# EAGLE design Steuerung (EAGLE 7.1.0)
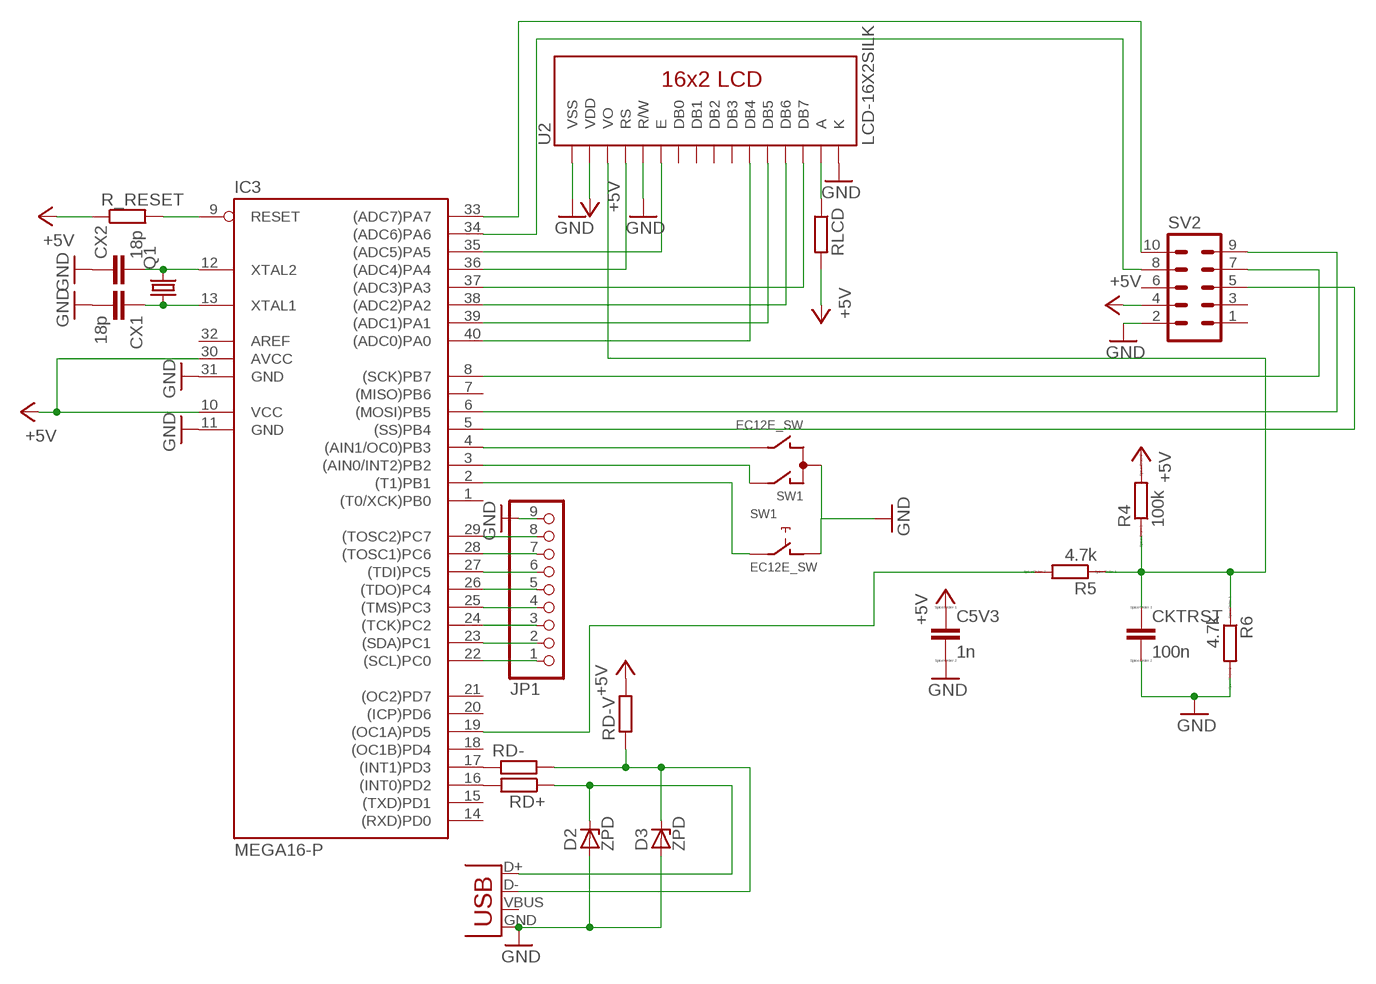
[diagram p0: schematic, sheet 1]

## Parts
C5V3  1n  C-EUC1206K  [C1206K]
CKTRST  100n  C-EUC1206K  [C1206K]
CX1  18p  C2,5-3  [C2.5-3]
CX2  18p  C2,5-3  [C2.5-3]
D2  ZPD  [DO35Z10]
D3  ZPD  [DO35Z10]
IC3  MEGA16-P  [DIL40]
JP1  PINHD-1X9  [1X09]
JP2  USBPTH-VERTICAL  [USB-B-PTH-VERTICAL]
Q1  CRYSTALHC18U-V  [HC18U-V]
R4  100k  R-EU_R1206W  [R1206W]
R5  4.7k  R-EU_R1206W  [R1206W]
R6  4.7k  R-EU_R1206W  [R1206W]
R_RESET  R-EU_R1206W  [R1206W]
RD+  R-EU_0309/12  [0309/12]
RD-  R-EU_0309/12  [0309/12]
RD-V  R-EU_0309/12  [0309/12]
RLCD  R-EU_0309/12  [0309/12]
SV2  ML10  [ML10]
SW1  EC12E_SW  [ALPS_EC12E_SW]
U2  LCD-16X2SILK  [LCD-16X2]

## Nets
+5V: C5V3.1 IC3.10(VCC) IC3.30(AVCC) R4.2 R_RESET.1 RD-V.2 RLCD.2 SV2.4 U2.2(VDD)
GND: C5V3.2 CKTRST.2 CX1.2 CX2.1 D2.A D3.A IC3.11(GND) IC3.31(GND) JP1.9 JP2.GND R6.2 SV2.2 SW1.C SW1.D U2.1(VSS) U2.5(R/W) U2.16(K)
KONTRAST: CKTRST.1 R4.1 R5.1 R6.1 U2.3(VO)
N$1: IC3.34((ADC6)PA6) SV2.8
N$2: IC3.4((AIN1/OC0)PB3) SW1.B
N$3: IC3.3((AIN0/INT2)PB2) SW1.A
N$4: IC3.2((T1)PB1) SW1.E
N$5: IC3.9(RESET) R_RESET.2
N$9: IC3.37((ADC3)PA3) U2.14(DB7)
N$10: IC3.36((ADC4)PA4) U2.4(RS)
N$11: IC3.35((ADC5)PA5) U2.6(E)
N$12: IC3.38((ADC2)PA2) U2.13(DB6)
N$13: IC3.39((ADC1)PA1) U2.12(DB5)
N$14: IC3.40((ADC0)PA0) U2.11(DB4)
N$15: RLCD.1 U2.15(A)
N$17: IC3.33((ADC7)PA7) SV2.10
N$18: IC3.5((SS)PB4) SV2.5
N$19: IC3.8((SCK)PB7) SV2.7
N$20: IC3.6((MOSI)PB5) SV2.9
N$21: IC3.29((TOSC2)PC7) JP1.8
N$22: IC3.28((TOSC1)PC6) JP1.7
N$23: IC3.27((TDI)PC5) JP1.6
N$24: IC3.26((TDO)PC4) JP1.5
N$25: IC3.25((TMS)PC3) JP1.4
N$26: IC3.24((TCK)PC2) JP1.3
N$27: IC3.23((SDA)PC1) JP1.2
N$28: IC3.22((SCL)PC0) JP1.1
N$29: CX1.1 IC3.13(XTAL1) Q1.1
N$30: CX2.2 IC3.12(XTAL2) Q1.2
N$31: IC3.16((INT0)PD2) RD+.2
N$32: IC3.17((INT1)PD3) RD-.1
N$33: D2.C JP2.D+ RD+.1
N$34: D3.C JP2.D- RD-.2 RD-V.1
PWM: IC3.19((OC1A)PD5) R5.2
Unconnected: IC3.1((T0/XCK)PB0) IC3.7((MISO)PB6) IC3.14((RXD)PD0) IC3.15((TXD)PD1) IC3.18((OC1B)PD4) IC3.20((ICP)PD6) IC3.21((OC2)PD7) IC3.32(AREF) JP2.VBUS SV2.1 SV2.3 SV2.6 SW1.GND1(G) SW1.GND2(G) U2.7(DB0) U2.8(DB1) U2.9(DB2) U2.10(DB3)

## Library data of the parts
C5V3 CKTRST = resistor:C-EU: CAPACITOR, European symbol; OC_FARNELL: unknown; SPICEPREFIX: C
CX1 CX2 = capacitor-wima:C: CAPACITOR naming: grid - package width; OC_FARNELL: unknown
D2 D3 = diode:ZPD: Z DIODE 500 mW; OC_FARNELL: unknown
IC3 = atmel:MEGA16-P: MICROCONTROLLER 16 Kbytes FLASH 1 kbytes SRAM 512 bytes EEPROM USART 8-channel 10 bit ADC Source: avr.lbr; MF: ATMEL; MPN: ATMEGA16-16PU; OC_FARNELL: 9171142; OC_NEWARK: 01M6885
JP1 = pinhead:PINHD-1X9: PIN HEADER; OC_FARNELL: unknown
JP2 = SparkFun-Connectors:USB: USB Connectors USB-B-PTH is fully proven SKU : PRT-00139/CONN-08278 USB-miniB is fully proven SKU : PRT-00587 USB-A-PCB is untested. USB-A-H is throughly reviewed, but untested. Spark Fun Electronics SKU : PRT-00437 USB-B-SMT is throughly reviewed, but untested. Needs silkscreen touching up. USB-A-S has not been used/tested USB-MB-H has not been used/tested USB-MICROB has been used. CONN-09505; OC_FARNELL: unknown
Q1 = crystal:CRYSTAL: CRYSTAL; OC_FARNELL: unknown; OC_NEWARK: unknown
R4-R6 = resistor:R-EU_: RESISTOR, European symbol; SPICEPREFIX: R
R_RESET RD+ RD- RD-V RLCD = rcl:R-EU_: RESISTOR, European symbol; OC_FARNELL: unknown
SV2 = con-harting-ml:ML10: HARTING; OC_FARNELL: unknown; OC_NEWARK: unknown
SW1 = switch-alps:EC12E_SW: ALPS rotary Encoder EC12E series with switch; MPN: EC12E2424407; OC_FARNELL: 1520813; OC_NEWARK: 74M1068
U2 = SparkFun-Displays:LCD-16X2: Standard text-only 16x2 parallel input LCD; OC_FARNELL: unknown

## Board
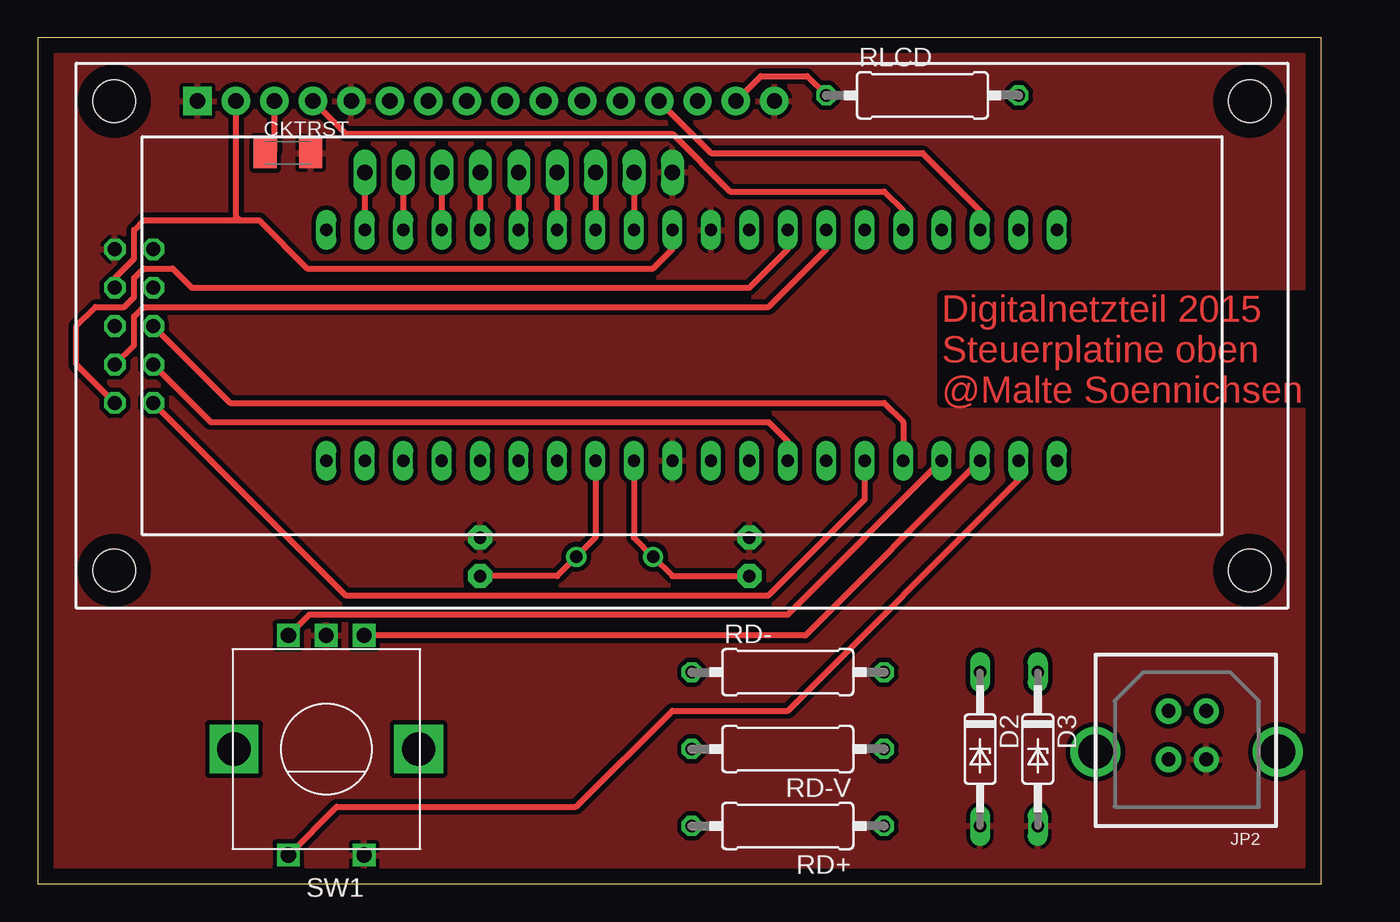
[diagram p1: board, top side]
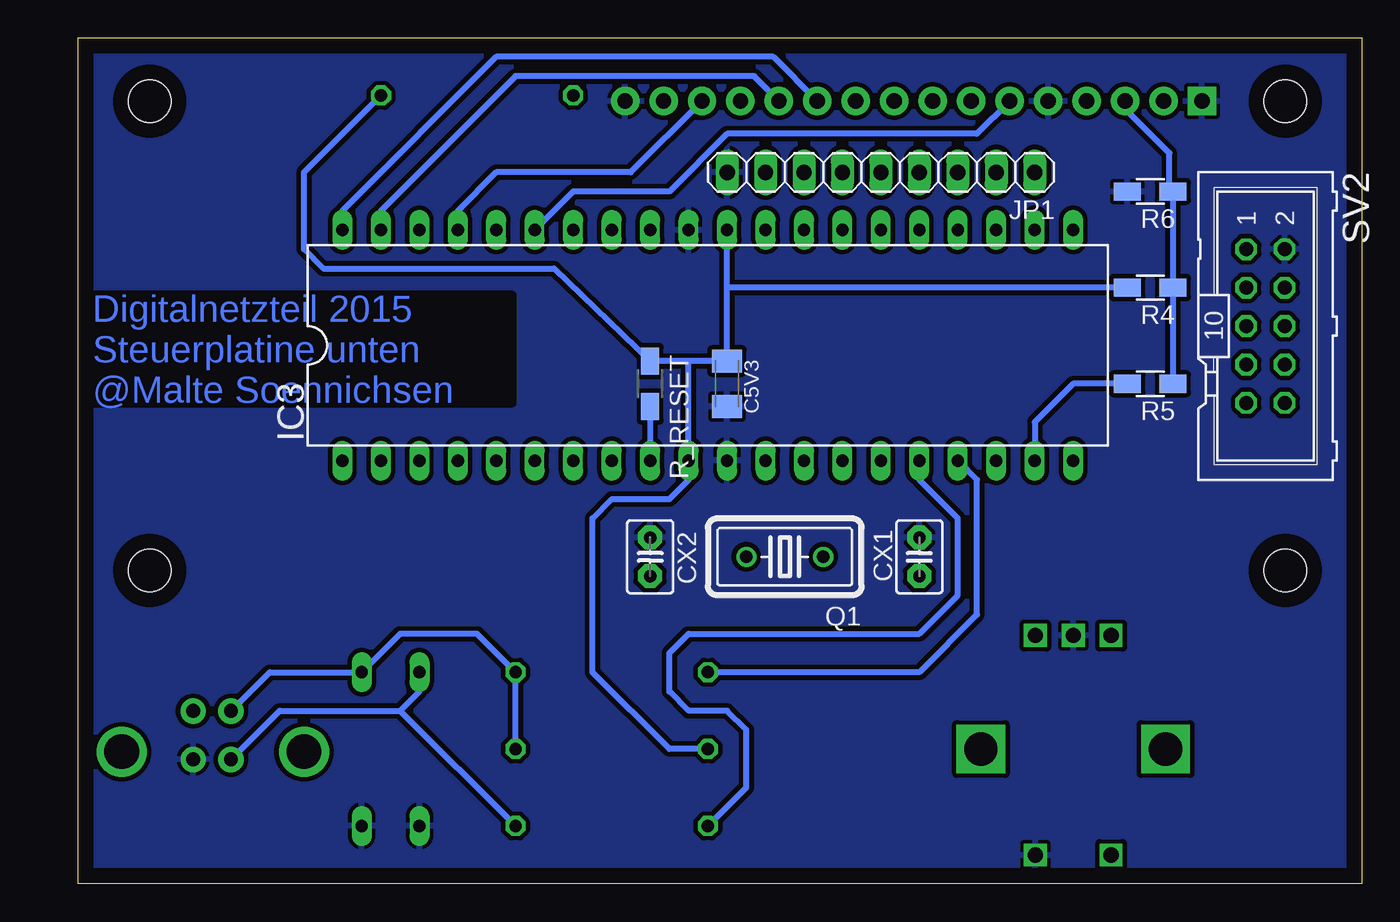
[diagram p2: board, bottom side, seen from below]

Size 84.76 x 55.87 mm. Coordinates in mm from the lower left corner, seen from the top.
Outline: 0,0 84.76,0 84.76,55.87 0,55.87 0,0
Copper layers (1*16): Top 0.035mm / dielectric 1.5mm / Bottom 0.035mm
Design rules "default": minimum track width 10mil, minimum drill 24mil, track to track 8mil, track to pad 8mil, pad to pad 8mil, via to via 8mil, smd to smd 8mil, copper to edge 40mil, drill to drill 8mil, minimum pad ring 10mil, minimum via ring 8mil, stop-mask expansion 4mil, vias tented up to drill 0mil, thermal gap 10mil

### Footprints (pad centres in the part's own frame; a part is rotated, then mirrored left to right if it is on the bottom)
C1206K = smd 1.5 x 2: 1 -1.5,0; 2 1.5,0
C2.5-3 = drill 0.813 pad 1.6 octagon: 1 -1.27,0; 2 1.27,0
DO35Z10 = drill 0.813 long: A 5.08,0; C -5.08,0
DIL40 = drill 0.813 long: 1 -24.13,-7.62; 2 -21.59,-7.62; 3 -19.05,-7.62; 4 -16.51,-7.62; 5 -13.97,-7.62; 6 -11.43,-7.62; 7 -8.89,-7.62; 8 -6.35,-7.62; 9 -3.81,-7.62; 10 -1.27,-7.62; 11 1.27,-7.62; 12 3.81,-7.62; 13 6.35,-7.62; 14 8.89,-7.62; 15 11.43,-7.62; 16 13.97,-7.62; 17 16.51,-7.62; 18 19.05,-7.62; 19 21.59,-7.62; 20 24.13,-7.62; 21 24.13,7.62; 22 21.59,7.62; 23 19.05,7.62; 24 16.51,7.62; 25 13.97,7.62; 26 11.43,7.62; 27 8.89,7.62; 28 6.35,7.62; 29 3.81,7.62; 30 1.27,7.62; 31 -1.27,7.62; 32 -3.81,7.62; 33 -6.35,7.62; 34 -8.89,7.62; 35 -11.43,7.62; 36 -13.97,7.62; 37 -16.51,7.62; 38 -19.05,7.62; 39 -21.59,7.62; 40 -24.13,7.62
1X09 = drill 1.016 long: 1 -10.16,0; 2 -7.62,0; 3 -5.08,0; 4 -2.54,0; 5 0,0; 6 2.54,0; 7 5.08,0; 8 7.62,0; 9 10.16,0
USB-B-PTH-VERTICAL = drill 0.914 pad 1.676: D+ 4.826,4.394; D- 4.826,7.595; GND 7.315,4.394; VBUS 7.315,7.595 | drill 2.286: P$1 0,4.902; P$2 12.04,4.902
HC18U-V = drill 0.813: 1 -2.54,0; 2 2.54,0
R1206W = smd 1.8 x 1.2: 1 -1.499,0; 2 1.499,0
0309/12 = drill 0.813 octagon: 1 -6.35,0; 2 6.35,0
ML10 = drill 0.914 octagon: 1 -5.08,-1.27; 2 -5.08,1.27; 3 -2.54,-1.27; 4 -2.54,1.27; 5 0,-1.27; 6 0,1.27; 7 2.54,-1.27; 8 2.54,1.27; 9 5.08,-1.27; 10 5.08,1.27
ALPS_EC12E_SW = drill 1 square: A -2.5,-7.5; B 2.5,-7.5; C 0,-7.5; D -2.5,7; E 2.5,7 | drill 2.2 square: GND1 -6.1,0; GND2 6.1,0
LCD-16X2 = drill 1.016 pad 1.88 square: 1 -32,15.5 | drill 1.016 pad 1.88: 2 -29.46,15.5; 3 -26.92,15.5; 4 -24.38,15.5; 5 -21.84,15.5; 6 -19.3,15.5; 7 -16.76,15.5; 8 -14.22,15.5; 9 -11.68,15.5; 10 -9.14,15.5; 11 -6.6,15.5; 12 -4.06,15.5; 13 -1.52,15.5; 14 1.02,15.5; 15 3.56,15.5; 16 6.1,15.5 | hole 2.8: -37.5,15.5; -37.5,-15.5; 37.5,15.5; 37.5,-15.5

### Placement (x,y rotation side)
C5V3  41.91,33.02 270 bottom
CKTRST  16.51,48.26 0 top
CX1  29.21,21.59 90 bottom
CX2  46.99,21.59 270 bottom
D2  62.23,8.89 270 top
D3  66.04,8.89 270 top
IC3  43.18,35.56 0 bottom
JP1  31.75,46.99 180 bottom
JP2  69.85,3.81 0 top
Q1  38.1,21.59 180 bottom
R4  13.97,39.37 180 bottom
R5  13.97,33.02 180 bottom
R6  13.97,45.72 180 bottom
R_RESET  46.99,33.02 270 bottom
RD+  49.53,3.81 180 top
RD-  49.53,13.97 0 top
RD-V  49.53,8.89 180 top
RLCD  58.42,52.07 0 top
SV2  6.35,36.83 270 bottom
SW1  19.05,8.89 180 top
U2  42.55,36.2 0 top

### Tracks (layer width: path | path; a pad name or v marks a point on that pad's centre or on a via)
+5V
  Top 0.406: SV2.4 5.08,40.01 6.35,41.27 6.35,43.18 6.99,43.81 13.34,43.81 | 13.34,43.81 13.09,44.06 U2.2 | 13.34,43.81 14.61,43.81 17.78,40.64 40.64,40.64 41.91,41.91 IC3.30
  Bottom 0.406: RD-V.2 45.72,8.89 50.8,13.97 50.8,24.13 49.53,25.4 45.72,25.4 44.45,26.67 IC3.10 44.45,34.52 | RLCD.2 69.85,46.99 69.85,41.91 68.58,40.64 53.34,40.64 R_RESET.1 44.45,34.52 | 41.91,39.37 C5V3.1 44.45,34.52 | 41.91,39.37 IC3.30 | R4.2 41.91,39.37
GND
  pour Bottom (isolate 0.305): 0,55.88 0,0 85.09,0 85.09,55.88
  pour Top (isolate 0.305): 0,55.88 85.09,55.88 85.09,0 0,0
KONTRAST
  Top 0.406: CKTRST.1 15.62,48.41 U2.3
  Bottom 0.406: U2.3 15.62,51.19 12.7,48.26 12.7,45.95 R6.1 R4.1 R5.1
N$1
  Top 0.406: SV2.8 6.35,35.56 6.35,37.47 6.99,38.1 48.26,38.1 52.07,41.91 IC3.34
N$2
  Top 0.406: SW1.B 17.94,17.78 49.53,17.78 IC3.4
N$3
  Top 0.406: IC3.3 50.68,16.39 SW1.A
N$4
  Top 0.406: SW1.E 19.74,5.08 35.56,5.08 41.91,11.43 49.53,11.43 64.77,26.67 IC3.2
N$5
  Bottom 0.406: R_RESET.2 IC3.9
N$9
  Bottom 0.406: U2.14 48.27,46.99 57.15,46.99 59.69,44.45 IC3.37
N$10
  Top 0.406: U2.4 20.33,49.53 41.91,49.53 45.72,45.72 55.88,45.72 57.15,44.45 IC3.36
N$11
  Bottom 0.406: U2.6 25.41,49.53 41.91,49.53 45.72,45.72 52.07,45.72 IC3.35
N$12
  Top 0.406: U2.13 44.46,48.26 58.42,48.26 62.23,44.45 IC3.38
N$13
  Bottom 0.406: U2.12 40.13,53.34 55.88,53.34 64.77,44.45 IC3.39
N$14
  Bottom 0.406: U2.11 38.86,54.61 57.15,54.61 67.31,44.45 IC3.40
N$15
  Top 0.406: U2.15 47.75,53.34 50.8,53.34 RLCD.1
N$17
  Top 0.406: SV2.10 2.54,34.29 2.54,36.83 3.81,38.1 5.71,38.1 6.35,38.73 6.35,40.01 6.99,40.64 8.89,40.64 10.16,39.37 46.99,39.37 49.53,41.91 IC3.33
N$18
  Top 0.406: SV2.5 12.7,31.75 55.88,31.75 57.15,30.48 IC3.5
N$19
  Top 0.406: SV2.7 11.43,30.48 48.26,30.48 49.53,29.21 IC3.8
N$20
  Top 0.406: SV2.9 20.32,19.05 48.26,19.05 54.61,25.4 IC3.6
N$21
  Top 0.406: JP1.8 IC3.29
N$22
  Top 0.406: JP1.7 IC3.28
N$23
  Top 0.406: JP1.6 IC3.27
N$24
  Top 0.406: JP1.5 IC3.26
N$25
  Top 0.406: JP1.4 IC3.25
N$26
  Top 0.406: JP1.3 IC3.24
N$27
  Top 0.406: JP1.2 IC3.23
N$28
  Top 0.406: JP1.1 IC3.22
N$29
  Top 0.406: IC3.13 36.83,22.86 Q1.1 34.29,20.32 CX1.1
N$30
  Top 0.406: IC3.12 39.37,22.86 Q1.2 41.91,20.32 CX2.2
N$31
  Bottom 0.406: RD+.2 40.64,6.35 40.64,10.16 41.91,11.43 44.45,11.43 45.72,12.7 45.72,15.24 44.45,16.51 29.21,16.51 26.67,19.05 26.67,24.13 29.21,26.67 IC3.16
N$32
  Bottom 0.406: RD-.1 29.21,13.97 25.4,17.78 25.4,26.67 IC3.17
N$33
  Bottom 0.406: JP2.D+ 71.45,11.43 63.5,11.43 | 63.5,11.43 62.23,12.7 D2.C | 63.5,11.43 RD+.1
N$34
  Bottom 0.406: JP2.D- 72.11,13.97 D3.C 63.5,16.51 58.42,16.51 RD-.2 RD-V.1
PWM
  Bottom 0.406: R5.2 19.05,33.02 21.59,30.48 IC3.19
(copper drawn outside any net)
  shapes: Bottom area x1

### Text on the board
Top: Digitalnetzteil 2015 / Steuerplatine oben / @Malte Soennichsen
Bottom: Digitalnetzteil 2015 / Steuerplatine unten / @Malte Soennichsen